# EAGLE design neopixelDriverBoard (EAGLE 8.7.0)
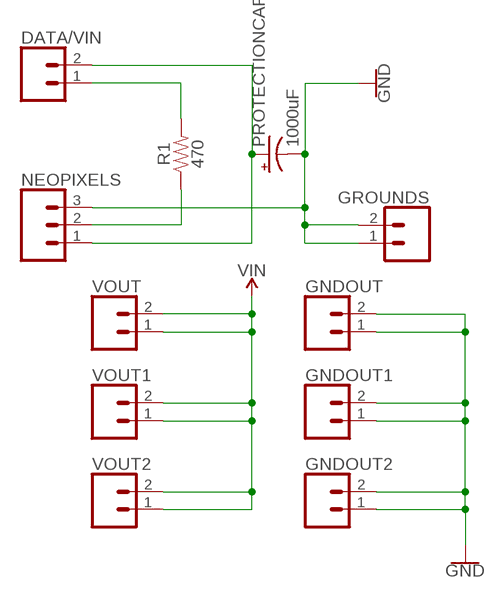
[diagram p0: schematic, sheet 1]

## Parts
DATA/VIN  CONN_025MM  [SCREWTERMINAL-5MM-2]
GNDOUT  CONN_025MM  [SCREWTERMINAL-5MM-2]
GNDOUT1  CONN_025MM  [SCREWTERMINAL-5MM-2]
GNDOUT2  CONN_025MM  [SCREWTERMINAL-5MM-2]
GROUNDS  CONN_025MM  [SCREWTERMINAL-5MM-2]
NEOPIXELS  CONN_03-SCREW-5MM  [SCREWTERMINAL-5MM-3]
PROTECTIONCAP  1000uF  1000UF-RADIAL-5MM-25V-20%  [CPOL-RADIAL-5MM-10MM]
R1  470  1KOHM-HORIZ_KIT-1/4W-1%  [AXIAL-0.3-KIT]
VOUT  CONN_025MM  [SCREWTERMINAL-5MM-2]
VOUT1  CONN_025MM  [SCREWTERMINAL-5MM-2]
VOUT2  CONN_025MM  [SCREWTERMINAL-5MM-2]

## Nets
DATA: NEOPIXELS.2 R1.P$1
GND: GNDOUT1.1 GNDOUT1.2 GNDOUT2.1 GNDOUT2.2 GNDOUT.1 GNDOUT.2 GROUNDS.1 GROUNDS.2 NEOPIXELS.3 PROTECTIONCAP.-
N$9: DATA/VIN.1 R1.P$2
VIN: DATA/VIN.2 NEOPIXELS.1 PROTECTIONCAP.+ VOUT1.1 VOUT1.2 VOUT2.1 VOUT2.2 VOUT.1 VOUT.2

## Library data of the parts
DATA/VIN GNDOUT GNDOUT1 GNDOUT2 GROUNDS VOUT VOUT1 VOUT2 = SparkFun-Connectors:CONN_02: Multi connection point. Often used as Generic Header-pin footprint for 0.1 inch spaced/style header connections On any of the 0.1 inch spaced packages, you can populate with these: Break Away Headers - Straight <https://www.sparkfun.com/products/116> (PRT-00116) Break Away Male Headers - Right Angle <https://www.sparkfun.com/products/553> (PRT-00553) Female Headers <https://www.sparkfun.com/products/115> (PRT-00115) Break Away Headers - Machine Pin <https://www.sparkfun.com/products/117> (PRT-00117) Break Away Female Headers - Swiss Machine Pin <https://www.sparkfun.com/products/743> (PRT-00743) For SCREWTERMINALS and SPRING TERMINALS visit here: Screw Terimnals on SparkFun.com <https://www.sparkfun.com/search/results?term=Screw+Terminals> (5mm/3.5mm/2.54mm spacing) This device is also useful as a general connection point to wire up your design to another part of your project. Our various solder wires solder well into these plated through hole pads. Hook-Up Wire - Assortment (Stranded, 22 AWG) <https://www.sparkfun.com/products/11375> (PRT-11375) Hook-Up Wire - Assortment (Solid Core, 22 AWG) <https://www.sparkfun.com/products/11367> (PRT-11367) View the entire wire category on our website here <https://www.sparkfun.com/categories/141> Special notes: Molex polarized connector foot print use with: PRT-08233 with associated crimp pins and housings. 2.54_SCREWTERM for use with PRT-10571. 3.5mm Screw Terminal footprints for PRT-08084 5mm Screw Terminal footprints for use with PRT-08432; SF_SKU: PRT-08432
NEOPIXELS = SparkFun-Connectors:CONN_03: Multi connection point. Often used as Generic Header-pin footprint for 0.1 inch spaced/style header connections On any of the 0.1 inch spaced packages, you can populate with these: Break Away Headers - Straight <https://www.sparkfun.com/products/116> (PRT-00116) Break Away Male Headers - Right Angle <https://www.sparkfun.com/products/553> (PRT-00553) Female Headers <https://www.sparkfun.com/products/115> (PRT-00115) Break Away Headers - Machine Pin <https://www.sparkfun.com/products/117> (PRT-00117) Break Away Female Headers - Swiss Machine Pin <https://www.sparkfun.com/products/743> (PRT-00743) Stackable Header - 3 Pin (Female, 0.1") <https://www.sparkfun.com/products/13875> (PRT-13875) For SCREWTERMINALS and SPRING TERMINALS visit here: Screw Terimnals on SparkFun.com <https://www.sparkfun.com/search/results?term=Screw+Terminals> (5mm/3.5mm/2.54mm spacing) This device is also useful as a general connection point to wire up your design to another part of your project. Our various solder wires solder well into these plated through hole pads. Hook-Up Wire - Assortment (Stranded, 22 AWG) <https://www.sparkfun.com/products/11375> (PRT-11375) Hook-Up Wire - Assortment (Solid Core, 22 AWG) <https://www.sparkfun.com/products/11367> (PRT-11367) View the entire wire category on our website here <https://www.sparkfun.com/categories/141> Special notes: Molex polarized connector foot print use with SKU : PRT-08232 with associated crimp pins and housings.; PROD_ID: CONN-10134; SF_SKU: PRT-08433
PROTECTIONCAP = SparkFun-Capacitors:1000UF: 1,000µF/1mF ceramic capacitors A capacitor is a passive two-terminal electrical component used to store electrical energy temporarily in an electric field. CAP-08070; PROD_ID: CAP-09538; VALUE: 1mF
R1 = SparkFun-Resistors:1KOHM: 1kΩ resistor A resistor is a passive two-terminal electrical component that implements electrical resistance as a circuit element. Resistors act to reduce current flow, and, at the same time, act to lower voltage levels within circuits. - Wikipedia; PROD_ID: RES-12182; VALUE: 1k

## Board
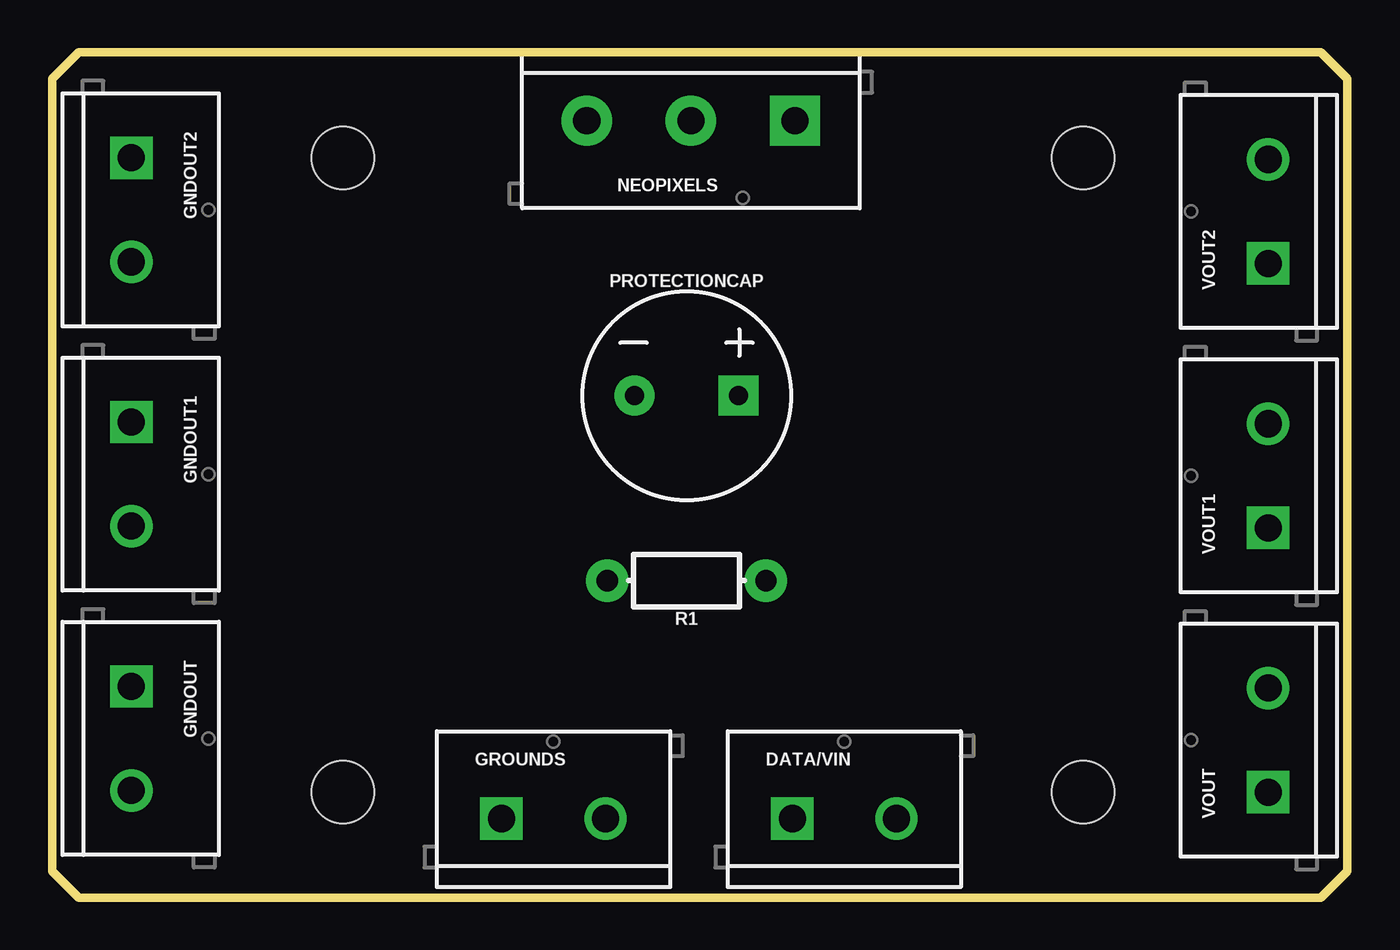
[diagram p1: board, top side]
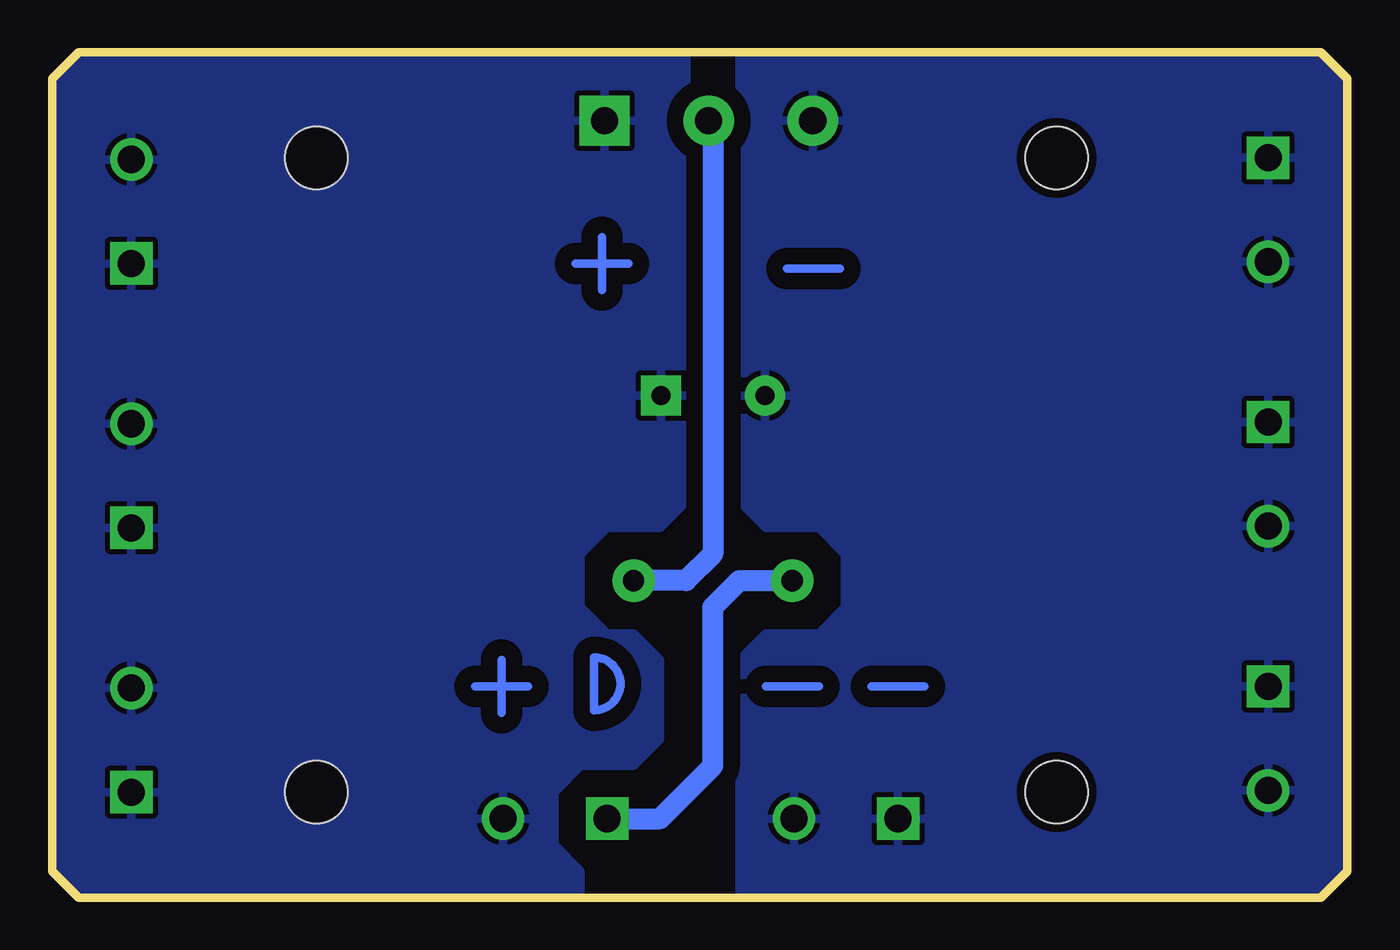
[diagram p2: board, bottom side, seen from below]

Size 62.23 x 40.64 mm. Coordinates in mm from the lower left corner, seen from the top.
Outline: 0,39.37 0,1.27 1.27,0 60.96,0 62.23,1.27 62.23,39.37 60.96,40.64 1.27,40.64 0,39.37
Copper layers (1*16): Top 0.035mm / dielectric 1.5mm / Bottom 0.035mm
Design rules "OthermillDRC_1_32_v2": minimum track width 8mil, minimum drill 0.8mm, track to track 0.794003125mm, track to pad 0.794003125mm, pad to pad 0.794003125mm, via to via 0.794003125mm, smd to smd 0mil, copper to edge 0mil, drill to drill 1mil, minimum pad ring 10mil, minimum via ring 10mil, stop-mask expansion 1mil, vias tented up to drill 30mil, thermal gap 10mil
Holes 3 mm at 49.53,5.08 13.97,5.08 13.97,35.56 49.53,35.56

### Footprints (pad centres in the part's own frame; a part is rotated, then mirrored left to right if it is on the bottom)
SCREWTERMINAL-5MM-2 = drill 1.3 pad 2.032 square: 1 0,0 | drill 1.3 pad 2.032: 2 5,0
SCREWTERMINAL-5MM-3 = drill 1.3 pad 2.413 square: 1 0,0 | drill 1.3 pad 2.413: 2 5,0; 3 10,0
CPOL-RADIAL-5MM-10MM = drill 0.9 pad 1.93 square: + 2.5,0 | drill 0.9 pad 1.93: - -2.5,0
AXIAL-0.3-KIT = drill 1.016 pad 2.032: P$1 -3.81,0; P$2 3.81,0

### Placement (x,y rotation side)
DATA/VIN  35.56,3.81 0 top
GNDOUT  3.81,10.16 270 top
GNDOUT1  3.81,22.86 270 top
GNDOUT2  3.81,35.56 270 top
GROUNDS  21.59,3.81 0 top
NEOPIXELS  35.69,37.34 180 top
PROTECTIONCAP  30.48,24.13 0 top
R1  30.48,15.24 180 top
VOUT  58.42,5.08 90 top
VOUT1  58.42,17.78 90 top
VOUT2  58.42,30.48 90 top

### Tracks (layer width: path | path; a pad name or v marks a point on that pad's centre or on a via)
DATA
  Bottom 1.016: NEOPIXELS.2 30.48,37.13 30.48,16.53 31.77,15.24 R1.P$1
GND
  pour Bottom (isolate 0.406): 29.21,40.64 29.21,19.05 27.94,17.78 25.4,17.78 24.13,16.51 24.13,13.97 25.4,12.7 27.94,12.7 29.21,11.43 29.21,0 1.27,0 0,1.27 0,39.37 1.27,40.64
N$1
  Bottom 0.406: 20.32,10.16 22.86,10.16
N$2
  Bottom 0.406: 25.4,10.16 27.94,10.16
N$3
  Bottom 0.406: 39.37,10.16 41.91,10.16
N$4
  Bottom 0.406: 34.54,30.48 37.08,30.48
N$5
  Bottom 0.406: 40.64,11.43 40.64,8.89
N$6
  Bottom 0.406: 36.2,11.56 36.2,9.02 arc-90 34.93,10.29 arc-90 36.2,11.56
N$7
  Bottom 0.406: 35.81,31.75 35.81,29.21
N$8
  Bottom 0.406: 26.92,30.23 24.38,30.23
N$9
  Bottom 1.016: DATA/VIN.1 33.02,3.81 30.48,6.35 30.48,13.97 29.21,15.24 R1.P$2
VIN
  pour Bottom: 31.75,40.64 31.75,19.05 33.02,17.78 35.56,17.78 36.83,16.51 36.83,13.97 35.56,12.7 34.29,12.7 33.02,11.43 33.02,7.62 34.29,6.35 36.83,6.35 38.1,5.08 38.1,2.54 36.83,1.27 36.83,0 60.96,0 62.23,1.27 62.23,39.37 60.96,40.64